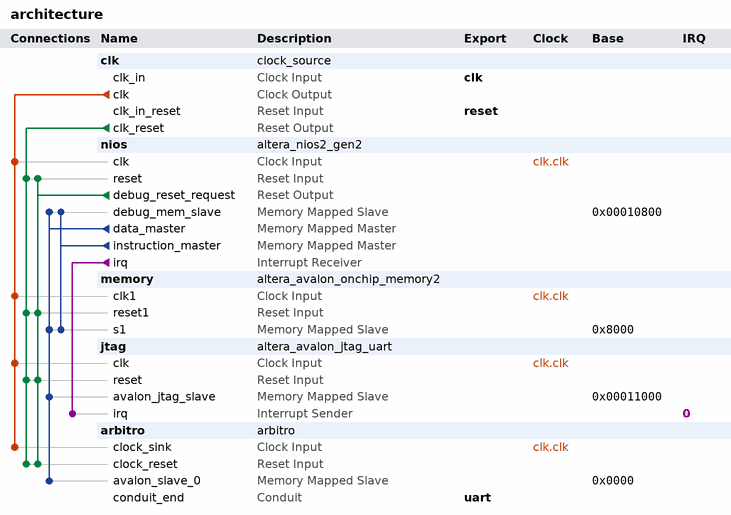
[diagram p0: system contents]
# Platform Designer (Qsys) system architecture, Cyclone IV E EP4CE30F23C6
# Parameters at their usual value, and those the tool derives, are not listed.
package require -exact qsys 18.1
create_system architecture
set_project_property DEVICE_FAMILY {Cyclone IV E}
set_project_property DEVICE EP4CE30F23C6

add_instance clk clock_source 18.1
set_instance_parameter_value clk clockFrequency 50000000

add_instance nios altera_nios2_gen2 18.1
set_instance_parameter_value nios dcache_size 2048
set_instance_parameter_value nios exceptionSlave memory.s1
set_instance_parameter_value nios icache_size 4096
set_instance_parameter_value nios impl Tiny
set_instance_parameter_value nios resetSlave memory.s1

add_instance memory altera_avalon_onchip_memory2 18.1
set_instance_parameter_value memory dataWidth 32
set_instance_parameter_value memory dualPort false
set_instance_parameter_value memory initMemContent true
set_instance_parameter_value memory initializationFileName onchip_mem.hex
set_instance_parameter_value memory memorySize 32768

add_instance jtag altera_avalon_jtag_uart 18.1
set_instance_parameter_value jtag simInteractiveOptions NO_INTERACTIVE_WINDOWS

add_instance arbitro arbitro 1.0
set_instance_parameter_value arbitro key 55
set_instance_parameter_value arbitro uart_clock_bit 5208

# connections
add_connection clk.clk arbitro.clock_sink clock
add_connection clk.clk jtag.clk clock
add_connection clk.clk memory.clk1 clock
add_connection clk.clk nios.clk clock
add_connection clk.clk_reset arbitro.clock_reset reset
add_connection clk.clk_reset jtag.reset reset
add_connection clk.clk_reset memory.reset1 reset
add_connection clk.clk_reset nios.reset reset
add_connection nios.debug_reset_request arbitro.clock_reset reset
add_connection nios.debug_reset_request jtag.reset reset
add_connection nios.debug_reset_request memory.reset1 reset
add_connection nios.debug_reset_request nios.reset reset
add_connection nios.data_master arbitro.avalon_slave_0 avalon
set_connection_parameter_value nios.data_master/arbitro.avalon_slave_0 baseAddress 0x0000
add_connection nios.data_master jtag.avalon_jtag_slave avalon
set_connection_parameter_value nios.data_master/jtag.avalon_jtag_slave baseAddress 0x00011000
add_connection nios.data_master memory.s1 avalon
set_connection_parameter_value nios.data_master/memory.s1 baseAddress 0x8000
add_connection nios.data_master nios.debug_mem_slave avalon
set_connection_parameter_value nios.data_master/nios.debug_mem_slave baseAddress 0x00010800
add_connection nios.instruction_master memory.s1 avalon
set_connection_parameter_value nios.instruction_master/memory.s1 baseAddress 0x8000
add_connection nios.instruction_master nios.debug_mem_slave avalon
set_connection_parameter_value nios.instruction_master/nios.debug_mem_slave baseAddress 0x00010800
add_connection nios.irq jtag.irq interrupt
set_connection_parameter_value nios.irq/jtag.irq irqNumber 0

# exported interfaces
add_interface clk clock sink
set_interface_property clk EXPORT_OF clk.clk_in
add_interface reset reset sink
set_interface_property reset EXPORT_OF clk.clk_in_reset
add_interface uart conduit end
set_interface_property uart EXPORT_OF arbitro.conduit_end

set_interconnect_requirement {$system} qsys_mm.clockCrossingAdapter HANDSHAKE
set_interconnect_requirement {$system} qsys_mm.enableEccProtection FALSE
set_interconnect_requirement {$system} qsys_mm.insertDefaultSlave FALSE
set_interconnect_requirement {$system} qsys_mm.maxAdditionalLatency 1

save_system architecture.qsys
